# EAGLE design SparkFun_MPU-9250_Breakout (EAGLE 8.4.3)
DESIGNER: Brent Wilkins; VERSION: v10
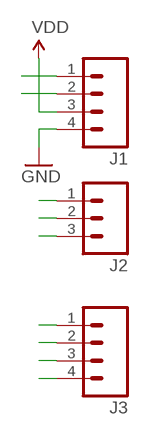
[diagram p0: schematic, sheet 1]

## Parts
J1  M04PTH  [1X04]
J2  M03PTH  [1X03]
J3  M04PTH  [1X04]

## Nets
!CS: J3.3
AD0/SDO: J3.2
AUX_CL: J2.1
AUX_DA: J2.3
FSYNC: J2.2
GND: J1.4
INT: J3.4
SCL/SCLK: J1.1
SDA/SDI: J1.2
VDD: J1.3
VDDIO: J3.1

## Library data of the parts
J1 J3 = SparkFun-Connectors:M04: Header 4 Standard 4-pin 0.1" header. Use with straight break away headers (SKU : PRT-00116), right angle break away headers (PRT-00553), swiss pins (PRT-00743), machine pins (PRT-00117), and female headers (PRT-00115). Molex polarized connector foot print use with SKU : PRT-08231 with associated crimp pins and housings. 1MM SMD Version SKU: PRT-10208; PROD_ID: CONN-09696
J2 = SparkFun-Connectors:M03: Header 3 Standard 3-pin 0.1" header. Use with straight break away headers (SKU : PRT-00116), right angle break away headers (PRT-00553), swiss pins (PRT-00743), machine pins (PRT-00117), and female headers (PRT-00115). Molex polarized connector foot print use with SKU : PRT-08232 with associated crimp pins and housings.

## Board
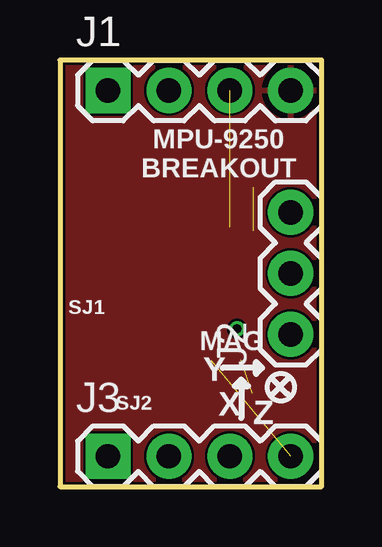
[diagram p1: board, top side]
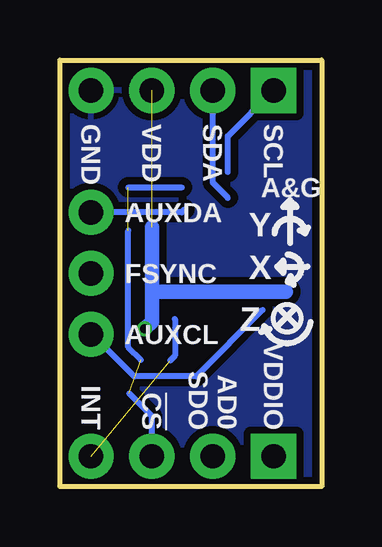
[diagram p2: board, bottom side, seen from below]

Size 10.92 x 17.78 mm. Coordinates in mm from the lower left corner, seen from the top.
Outline: 0,0 10.92,0 10.92,17.78 0,17.78 0,0
Copper layers (1*16): Top 0.035mm / dielectric 1.5mm / Bottom 0.035mm
Design rules "SparkFun-2-layer-FAB-LIMIT": minimum track width 4mil, minimum drill 6mil, track to track 4mil, track to pad 4mil, pad to pad 4mil, via to via 4mil, smd to smd 4mil, copper to edge 4mil, drill to drill 4mil, minimum pad ring 5mil, minimum via ring 5mil, stop-mask expansion 4mil, vias tented up to drill 20mil, thermal gap 10mil

### Footprints (pad centres in the part's own frame; a part is rotated, then mirrored left to right if it is on the bottom)
1X04 = drill 1.016 pad 1.88 square: 1 0,0 | drill 1.016 pad 1.88: 2 2.54,0; 3 5.08,0; 4 7.62,0
1X03 = drill 1.016 pad 1.88: 1 0,0; 2 2.54,0; 3 5.08,0

### Placement (x,y rotation side)
J1  2.01,16.51 0 top
J2  9.63,6.35 90 top
J3  2.01,1.27 0 top

### Tracks (layer width: path | path; a pad name or v marks a point on that pad's centre or on a via)
!CS  (2 unrouted)
  Bottom 0.254: J3.3 7.09,2.95 8.03,3.89 | 7.54,5.28 8.08,5.82 8.08,10.67 | 8.08,12.47 8.07,12.48 5.84,12.48
AUX_CL
  Bottom 0.254: 2.46,7.37 5.23,4.6 7.82,4.6 9.58,6.35 J2.1
AUX_DA
  Bottom 0.254: 5.71,11.56 5.84,11.43 J2.3
GND
  pour Top: -0.03,17.81 10.9,17.78 10.9,0 0,0
  pour Bottom (isolate 0.305): 0,0 10.92,0 10.92,17.78 0,17.78
INT  (1 unrouted)
  Bottom 0.254: 6.12,6.99 6.12,5.46 6.33,5.26
SCL/SCLK
  Bottom 0.254: 3.91,13.11 3.91,14.61 J1.1
SDA/SDI
  Bottom 0.254: 3.91,12.04 4.55,12.68 J1.2
VDD  (via drill 0.38)  (1 unrouted)
  Top 0.254: 7.49,6.68 v7.39,6.58
  Bottom 0.61: 7.09,10.82 7.09,8.18 | 7.09,8.18 7.09,6.88 v7.39,6.58 | 1.5,8.13 7.04,8.13 7.09,8.18

### Text on the board
tPlace: MPU-9250 / BREAKOUT | SJ1 | MAG | SJ2 | Y | X | Z
bPlace: SCL | SDA | VDD | GND | A&G | AUXDA | Y | X | FSYNC | Z | AUXCL | VDDIO | AD0 / SDO | !CS | INT